# EAGLE schematic motherboard (EAGLE 6.1)
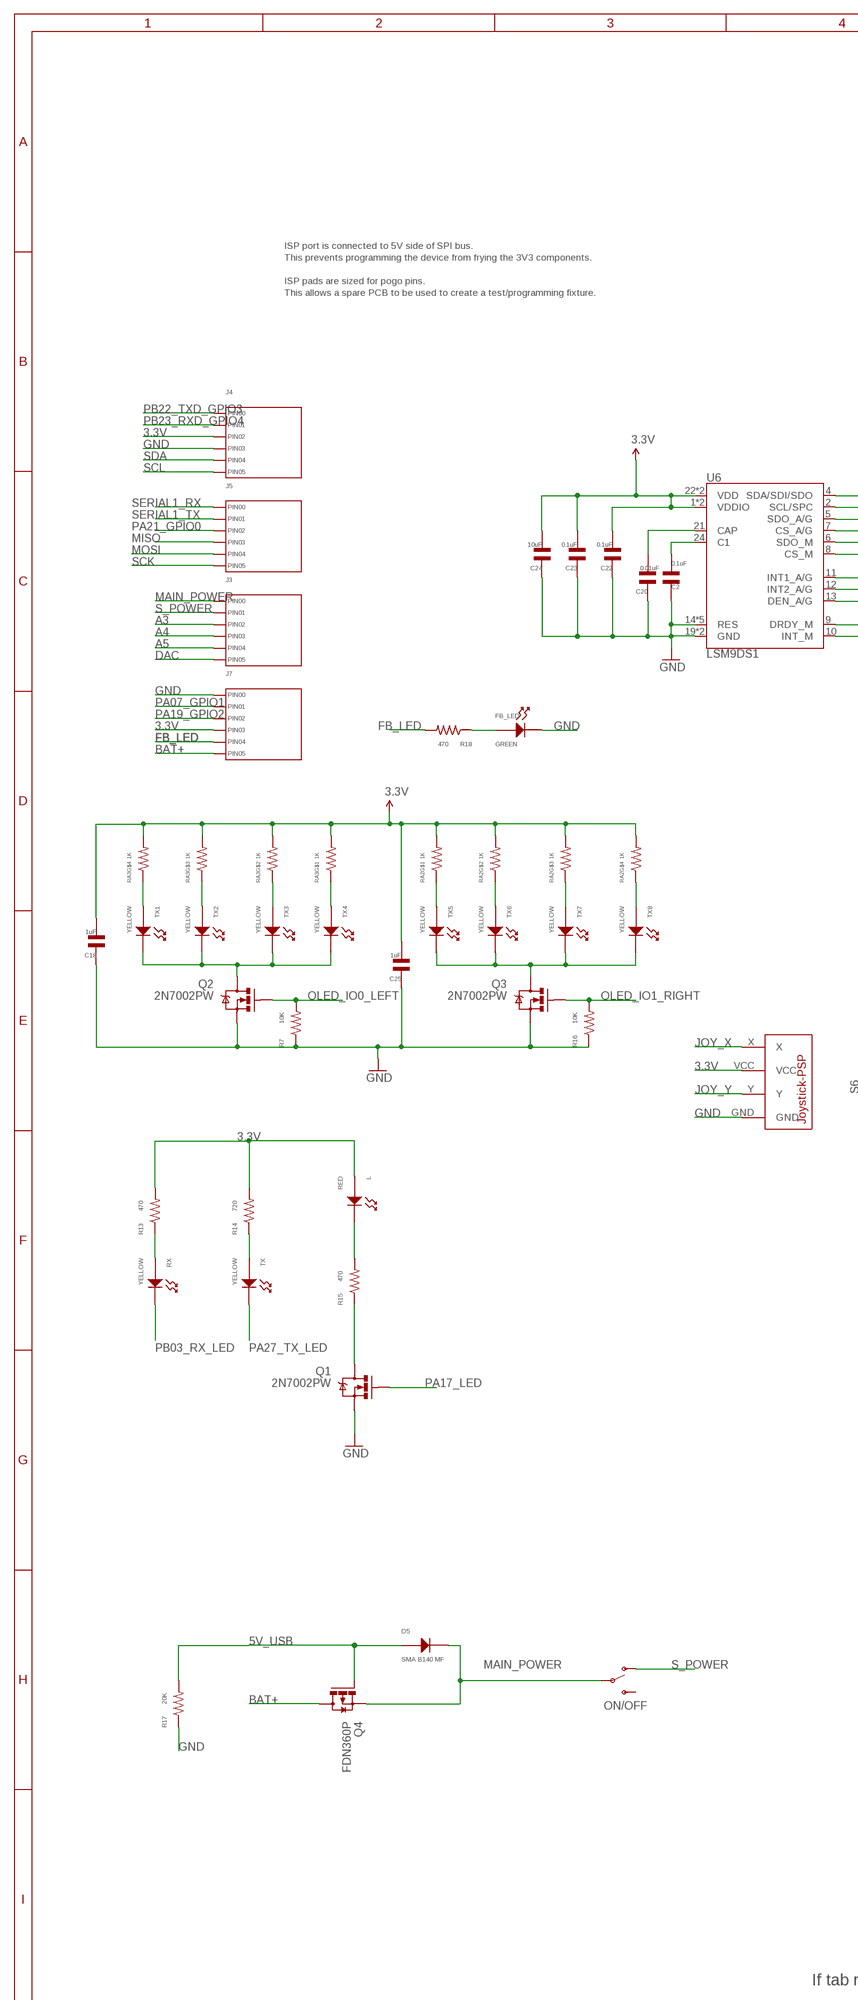
[diagram p0: schematic, sheet 1, part 1 of 2]
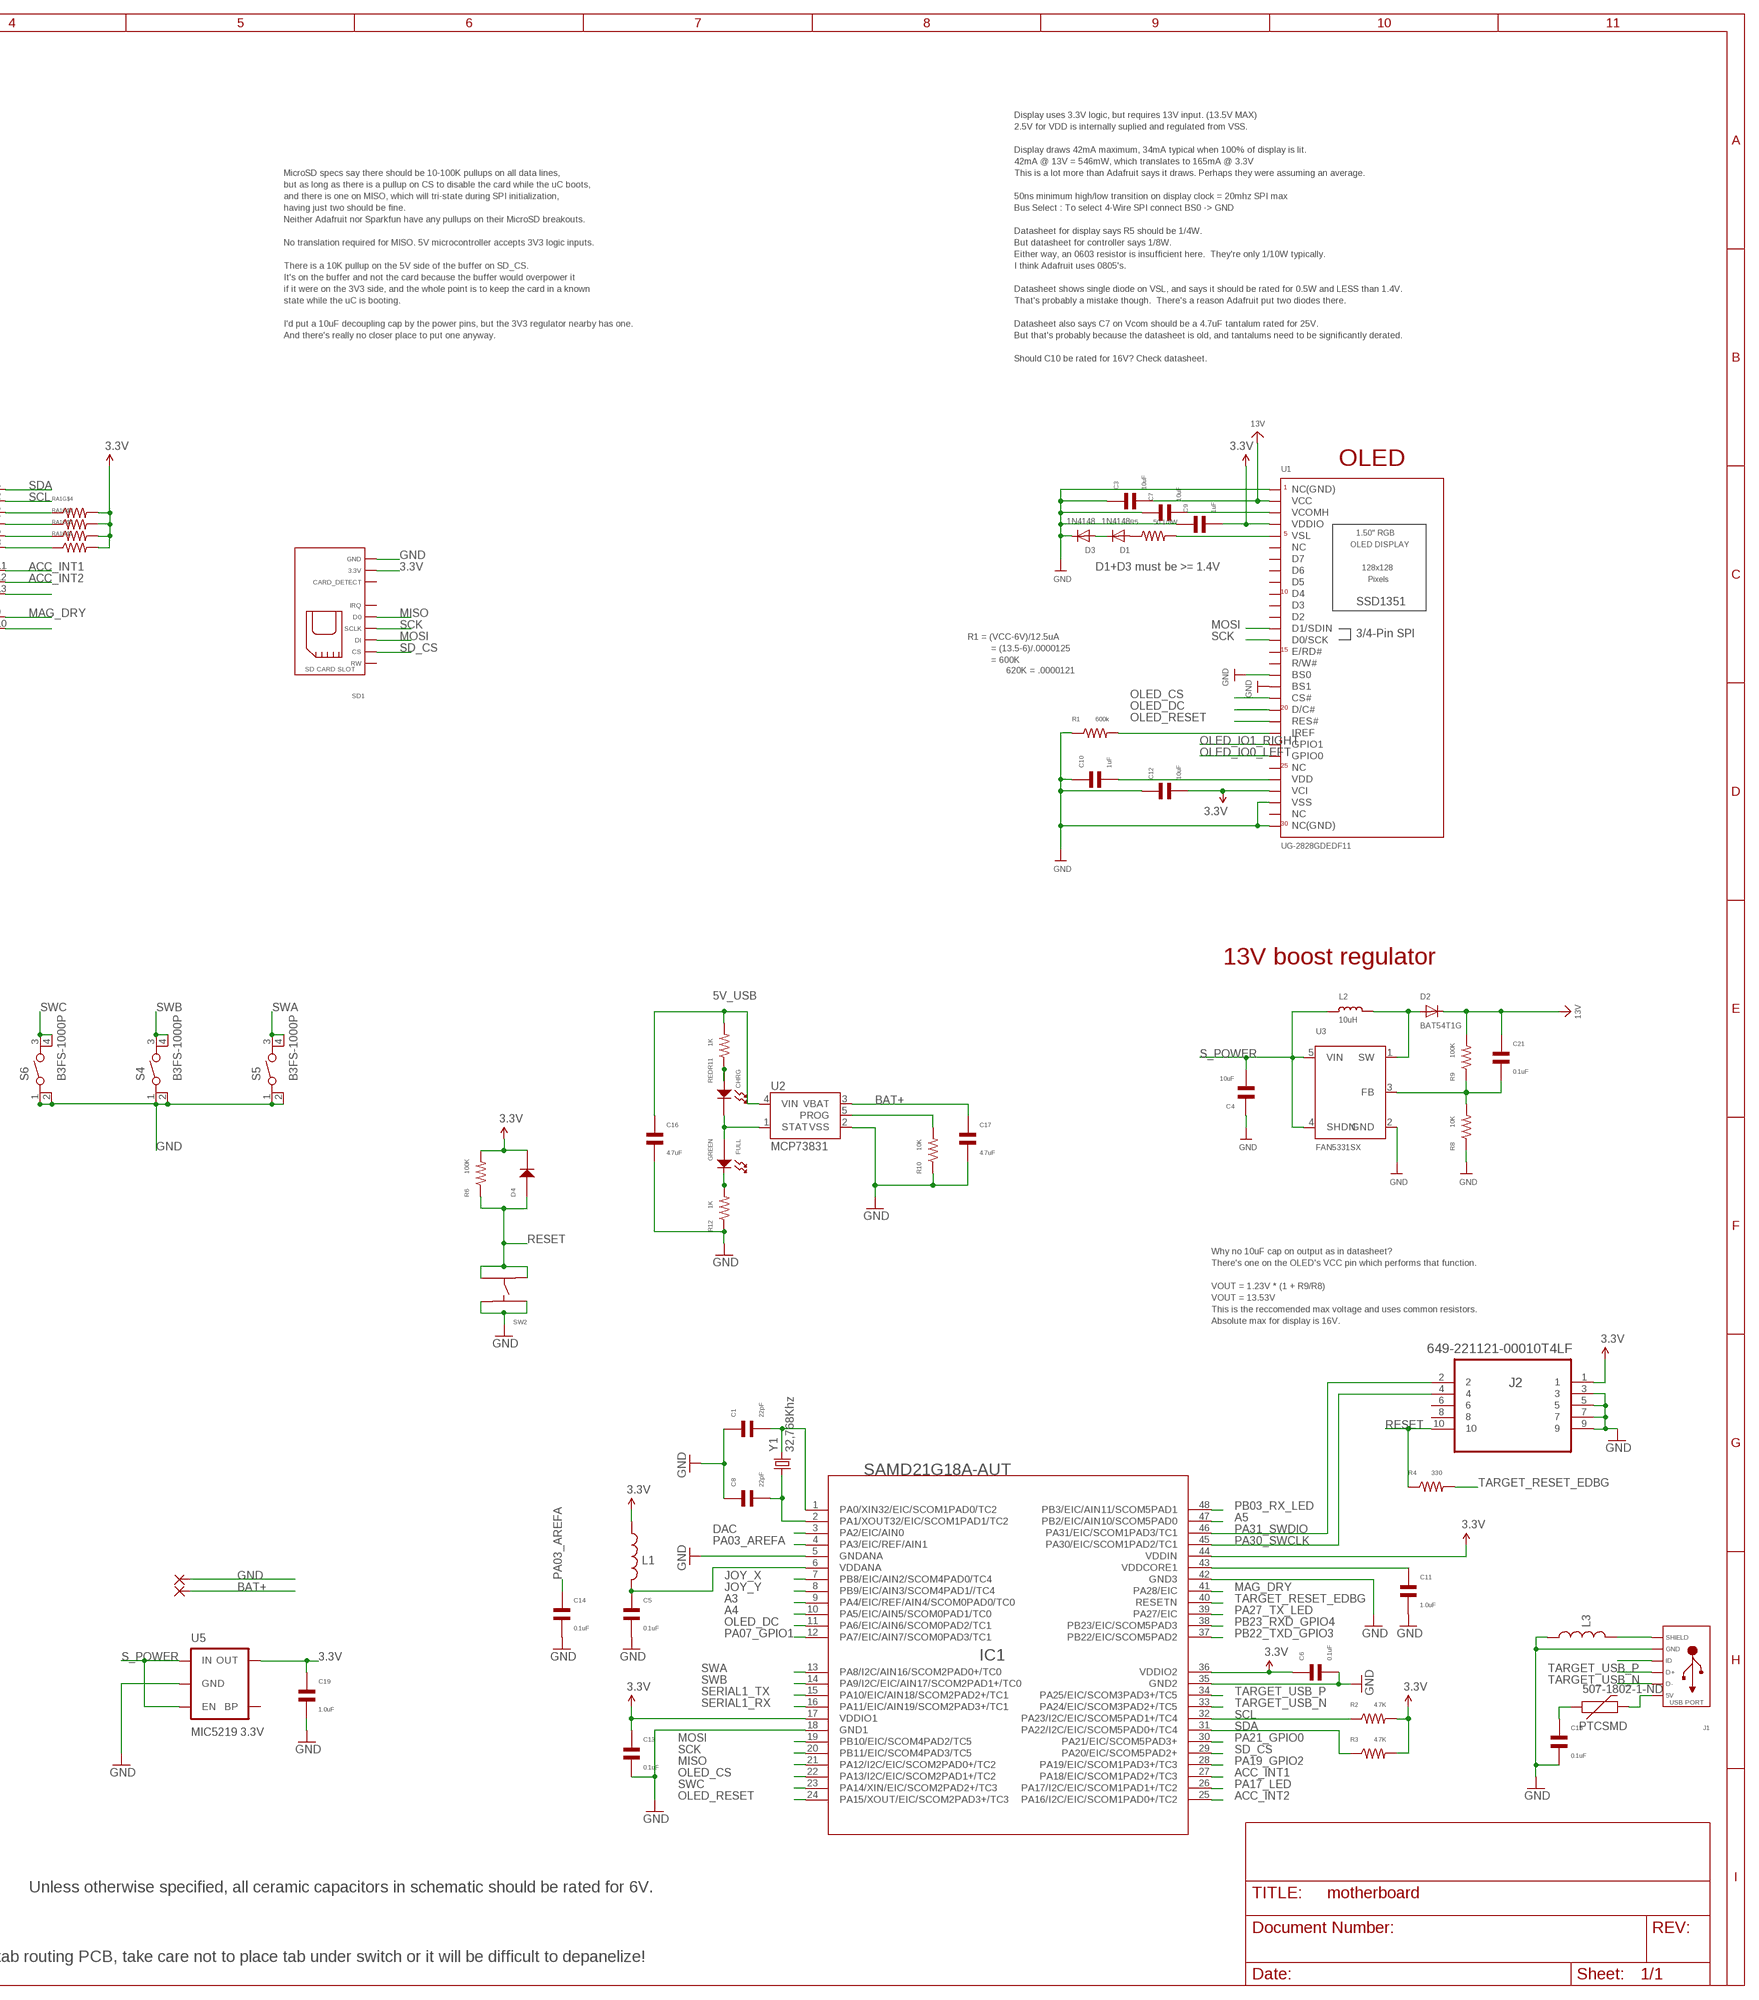
[diagram p1: schematic, sheet 1, part 2 of 2]

## Parts
507-1802-1-ND  PTCSMD  [PTC-1206]
C1  22pF  CAPACITOR_NP_0402  [C0402]
C2  0.1uF  CAPACITOR_NP_0402  [C0402]
C3  10uF  CAPACITOR_NP_0603  [C0603]
C4  10uF  CAPACITOR_NP_0603  [C0603]
C5  0.1uF  CAPACITOR_NP_0402  [C0402]
C6  0.1uF  CAPACITOR_NP_0402  [C0402]
C7  10uF  CAPACITOR_NP_0603  [C0603]
C8  22pF  CAPACITOR_NP_0402  [C0402]
C9  1uF  CAPACITOR_NP_0603  [C0603]
C10  1uF  CAPACITOR_NP_0603  [C0603]
C11  1.0uF  CAPACITOR_NP_0402  [C0402]
C12  10uF  CAPACITOR_NP_0603  [C0603]
C13  0.1uF  CAPACITOR_NP_0402  [C0402]
C14  0.1uF  CAPACITOR_NP_0402  [C0402]
C15  0.1uF  CAPACITOR_NP_0402  [C0402]
C16  4.7uF  CAPACITOR_NP_0603  [C0603]
C17  4.7uF  CAPACITOR_NP_0603  [C0603]
C18  1uF  CAPACITOR_NP_0402  [C0402]
C19  1.0uF  CAPACITOR_NP_0603  [C0603]
C20  0.01uF  CAPACITOR_NP_0402  [C0402]
C21  0.1uF  CAPACITOR_NP_0603  [C0603]
C22  0.1uF  CAPACITOR_NP_0402  [C0402]
C23  0.1uF  CAPACITOR_NP_0402  [C0402]
C24  10uF  CAPACITOR_NP_0603  [C0603]
C25  1uF  CAPACITOR_NP_0402  [C0402]
CHRG  RED  LED_SINGLE_0603  [LED0603]
D1  1N4148  DIODESOD-323  [SOD-323]
D2  BAT54T1G  DIODESOD-123  [SOD-123]
D3  1N4148  DIODESOD-323  [SOD-323]
D4  DIODE_SOD-123  [SOD-123]
D5  SMA B140 MF  DIODE_SMA  [SMA]
FB_LED  GREEN  LED_SINGLE_0603  [LED0603]
FULL  GREEN  LED_SINGLE_0603  [LED0603]
IC1  SAMD21G18A-AUT  INTEGRATEDCIRCUITS_1792_SAMD21G18A-AUT  [INTEGRATEDCIRCUITS_TQFP48-7X7]
J1  USB_MICRO_RIGHT  [MICROUSB-RIGHT]
J2  649-221121-00010T4LF  FTSH-105-01-L-DV  [SAMTEC_FTSH-105-01-L-DV]
J3  HEADER_01X06_PTH_2.54MM  [PTH_2.54MM_01X06]
J4  HEADER_01X06_PTH_2.54MM  [PTH_2.54MM_01X06]
J5  HEADER_01X06_PTH_2.54MM  [PTH_2.54MM_01X06]
J7  HEADER_01X06_PTH_2.54MM  [PTH_2.54MM_01X06]
L  RED  LED_SINGLE_0603  [LED0603]
L1  INDUCTOR0603-TDK  [0603-TDK]
L2  10uH  INDUCTOR  [INDUCTOR_1007]
L3  INDUCTOR0603-TDK  [0603-TDK]
ON/OFF  SWITCH-SPDT-SMD-A  [SWITCH-SPST-SMD-A]
PAD1  WIREPADSMD1,27-254  [SMD1,27-2,54]
PAD2  WIREPADSMD1,27-254  [SMD1,27-2,54]
Q1  2N7002PW  MOSFET-NCHANNEL2N7002PW  [SOT323]
Q2  2N7002PW  MOSFET-NCHANNEL2N7002PW  [SOT323]
Q3  2N7002PW  MOSFET-NCHANNEL2N7002PW  [SOT323]
Q4  FDN360P  [SUPER-SOT3]
R1  600k  RESISTOR_0603  [R0603]
R2  4.7K  RESISTOR_0402  [R0402]
R3  4.7K  RESISTOR_0402  [R0402]
R4  330  RESISTOR_0402  [R0402]
R5  50 1/8W  RESISTOR_0805  [R0805]
R6  100K  RESISTOR_0402  [R0402]
R7  10K  RESISTOR_0402  [R0402]
R8  10K  RESISTOR_0603  [R0603]
R9  100K  RESISTOR_0603  [R0603]
R10  10K  RESISTOR_0402  [R0402]
R11  1K  RESISTOR_0402  [R0402]
R12  1K  RESISTOR_0402  [R0402]
R13  470  RESISTOR_0402  [R0402]
R14  720  RESISTOR_0402  [R0402]
R15  470  RESISTOR_0402  [R0402]
R16  10K  RESISTOR_0402  [R0402]
R17  20K  RESISTOR_0402  [R0402]
R18  470  RESISTOR_0402  [R0402]
RA1  RESISTOR_QUAD_ARRAY_A1206  [RA1206]
RA2  1K  RESISTOR_QUAD_ARRAY_A1206  [RA1206]
RA3  1K  RESISTOR_QUAD_ARRAY_A1206  [RA1206]
RX  YELLOW  LED_SINGLE_0603  [LED0603]
S4  B3FS-1000P  [B3FS]
S5  B3FS-1000P  [B3FS]
S6  B3FS-1000P  [B3FS]
SD1  SD_CARD_SLOT_MICRO_RIGHT  [MICROSDSLOT-RIGHT]
SW2  TACT_4.2MM  [TACT4.2MM]
TX  YELLOW  LED_SINGLE_0603  [LED0603]
TX1  YELLOW  LED_SINGLE_0603  [LED0603]
TX2  YELLOW  LED_SINGLE_0603  [LED0603]
TX3  YELLOW  LED_SINGLE_0603  [LED0603]
TX4  YELLOW  LED_SINGLE_0603  [LED0603]
TX5  YELLOW  LED_SINGLE_0603  [LED0603]
TX6  YELLOW  LED_SINGLE_0603  [LED0603]
TX7  YELLOW  LED_SINGLE_0603  [LED0603]
TX8  YELLOW  LED_SINGLE_0603  [LED0603]
U1  UG-2828GDEDF11  DISP_OLED_UG-2828GDEDF11TOP  [FPC_XF2M-3015-1A]
U2  MCP73831  [SOT23-5]
U3  FAN5331SX  FAN5331  [SOT23-5]
U5  MIC5219 3.3V  V_REG_MIC52193.3V  [SOT23-5]
U6  LSM9DS1  [LGA24-8X4]
U$2  JOYSTICK-PSP1000  [JOYSTICK-PSP1000]
Y1  32,768Khz  CRYSTAL2012  [CRYSTAL-SMD-2.0X1.2]

## Nets
3.3V [10mil]: C6.P$1 C9.P$2 C12.P$2 C13.P$1 C18.P$2 C19.P$1 C22.P$2 C23.P$2 C24.P$2 C25.P$2 D4.CATHODE IC1.17(VDDIO1) IC1.36(VDDIO2) IC1.44(VDDIN) J2.1 J4.P$3(PIN2) J7.P$4(PIN3) L1.1 L.ANODE R2.P$2 R3.P$2 R6.P$2 R13.P$2 R14.P$2 RA1.P$5 RA1.P$6 RA1.P$7 RA1.P$8 RA2.P$5 RA2.P$6 RA2.P$7 RA2.P$8 RA3.P$5 RA3.P$6 RA3.P$7 RA3.P$8 SD1.PIN4(3.3V) U1.P$4(VCI) U1.P$27(VDDIO) U5.5(OUT) U6.1(VDDIO) U6.3(VDDIO) U6.22(VDD) U6.23(VDD) U$2.VCC
5V_NP [Large]: 507-1802-1-ND.2 J1.1(5V)
5V_USB [Large]: 507-1802-1-ND.1 C15.P$1 C16.P$1 D5.ANODE Q4.1(G) R11.P$2 R17.P$2 U2.4(VIN)
13V [10mil]: C3.P$2 C21.P$1 D2.C R9.P$2 U1.P$29(VCC)
A3: IC1.9(PA4/EIC/REF/AIN4/SCOM0PAD0/TC0) J3.P$3(PIN2)
A4: IC1.10(PA5/EIC/AIN5/SCOM0PAD1/TC0) J3.P$4(PIN3)
A5: IC1.47(PB2/EIC/AIN10/SCOM5PAD0) J3.P$5(PIN4)
ACC_INT1: IC1.27(PA18/EIC/SCOM1PAD2+/TC3) U6.11(INT1_A/G)
ACC_INT2: IC1.25(PA16/I2C/EIC/SCOM1PAD0+/TC2) U6.12(INT2_A/G)
BAT+ [Large]: C17.P$1 J7.P$6(PIN5) PAD1.1(P) Q4.3(D) U2.3(VBAT)
CHG_STATUS: CHRG.CATHODE FULL.ANODE U2.1(STAT)
DAC: IC1.3(PA2/EIC/AIN0) J3.P$6(PIN5)
FB: C21.P$2 R8.P$2 R9.P$1 U3.3(FB)
FB_LED [Large]: J7.P$5(PIN4) R18.P$2
GND [gnd]: C1.P$1 C2.P$2 C3.P$1 C4.P$1 C5.P$2 C6.P$2 C7.P$1 C8.P$1 C9.P$1 C10.P$1 C11.P$2 C12.P$1 C13.P$2 C14.P$2 C15.P$2 C16.P$2 C17.P$2 C18.P$1 C19.P$2 C20.P$1 C22.P$1 C23.P$1 C24.P$1 C25.P$1 D3.C FB_LED.CATHODE IC1.5(GNDANA) IC1.18(GND1) IC1.35(GND2) IC1.42(GND3) J1.5(GND) J2.3 J2.5 J2.7 J2.9 J4.P$4(PIN3) J7.P$1(PIN0) L3.1 PAD2.1(P) Q1.2(S) Q2.2(S) Q3.2(S) R1.P$1 R7.P$1 R8.P$1 R10.P$1 R12.P$1 R16.P$1 R17.P$1 S4.1(A1) S4.2(A2) S5.1(A1) S5.2(A2) S6.1(A1) S6.2(A2) SD1.G0(GND) SD1.G1(GND) SD1.PIN6(GND) SW2.P$1 SW2.P$2 U1.P$1(NC(GND)) U1.P$3(VSS) U1.P$13(BS1) U1.P$14(BS0) U1.P$30(NC(GND)) U2.2(VSS) U3.2(GND) U5.2(GND) U6.14(RES) U6.15(RES) U6.16(RES) U6.17(RES) U6.18(RES) U6.19(GND) U6.20(GND) U$2.GND
JOY_X: IC1.7(PB8/EIC/AIN2/SCOM4PAD0/TC4) U$2.X
JOY_Y: IC1.8(PB9/EIC/AIN3/SCOM4PAD1//TC4) U$2.Y
MAG_DRY: IC1.41(PA28/EIC) U6.9(DRDY_M)
MAIN_POWER: D5.CATHODE J3.P$1(PIN0) ON/OFF.2(P) Q4.2(S)
MISO: IC1.21(PA12/I2C/EIC/SCOM2PAD0+/TC2) J5.P$4(PIN3) SD1.PIN7(D0)
MOSI: IC1.19(PB10/EIC/SCOM4PAD2/TC5) J5.P$5(PIN4) SD1.PIN3(DI) U1.P$18(D1/SDIN)
N$1: R10.P$2 U2.5(PROG)
N$2 [10mil]: Q2.3(D) TX1.CATHODE TX2.CATHODE TX3.CATHODE TX4.CATHODE
N$3: D1.A R5.P$1
N$4: C10.P$2 U1.P$5(VDD)
N$5: CHRG.ANODE R11.P$1
N$6: J1.S1(SLD) J1.S2(SLD) J1.S3(SLD) J1.S4(SLD) J1.S5(SLD) J1.S6(SLD) L3.2
N$7: Q3.3(D) TX5.CATHODE TX6.CATHODE TX7.CATHODE TX8.CATHODE
N$8: R1.P$2 U1.P$9(IREF)
N$9: R13.P$1 RX.ANODE
N$10: R14.P$1 TX.ANODE
N$11: J1.4(ID)
N$12: FULL.CATHODE R12.P$2
N$13: Q1.3(D) R15.P$1
N$14: L.CATHODE R15.P$2
N$15 [10mil]: RA2.P$1 TX5.ANODE
N$16 [10mil]: RA2.P$2 TX6.ANODE
N$17: RA1.P$4 U6.5(SDO_A/G)
N$18: RA1.P$2 U6.7(CS_A/G)
N$19: RA1.P$3 U6.6(SDO_M)
N$20: RA1.P$1 U6.8(CS_M)
N$21 [10mil]: RA2.P$3 TX7.ANODE
N$22 [10mil]: RA2.P$4 TX8.ANODE
N$23: U6.13(DEN_A/G)
N$24: FB_LED.ANODE R18.P$1
N$25: U6.10(INT_M)
N$26 [10mil]: RA3.P$1 TX4.ANODE
N$27: C20.P$2 U6.21(CAP)
N$28: C2.P$1 U6.24(C1)
N$29 [10mil]: RA3.P$2 TX3.ANODE
N$30 [10mil]: RA3.P$3 TX2.ANODE
N$31 [10mil]: RA3.P$4 TX1.ANODE
OLED_CS: IC1.22(PA13/I2C/EIC/SCOM2PAD1+/TC2) U1.P$12(CS#)
OLED_DC: IC1.11(PA6/EIC/AIN6/SCOM0PAD2/TC1) U1.P$11(D/C#)
OLED_IO0_LEFT: Q2.1(G) R7.P$2 U1.P$7(GPIO0)
OLED_IO1_RIGHT: Q3.1(G) R16.P$2 U1.P$8(GPIO1)
OLED_RESET: IC1.24(PA15/XOUT/EIC/SCOM2PAD3+/TC3) U1.P$10(RES#)
PA00_XIN32: C1.P$2 IC1.1(PA0/XIN32/EIC/SCOM1PAD0/TC2) Y1.2
PA01_XOUT32: C8.P$2 IC1.2(PA1/XOUT32/EIC/SCOM1PAD1/TC2) Y1.1
PA03_AREFA: C14.P$1 IC1.4(PA3/EIC/REF/AIN1)
PA07_GPIO1: IC1.12(PA7/EIC/AIN7/SCOM0PAD3/TC1) J7.P$2(PIN1)
PA17_LED: IC1.26(PA17/I2C/EIC/SCOM1PAD1+/TC2) Q1.1(G)
PA19_GPIO2: IC1.28(PA19/EIC/SCOM1PAD3+/TC3) J7.P$3(PIN2)
PA21_GPIO0: IC1.30(PA21/EIC/SCOM5PAD3+) J5.P$3(PIN2)
PA27_TX_LED: IC1.39(PA27/EIC) TX.CATHODE
PA30_SWCLK: IC1.45(PA30/EIC/SCOM1PAD2/TC1) J2.4
PA31_SWDIO: IC1.46(PA31/EIC/SCOM1PAD3/TC1) J2.2
PB03_RX_LED: IC1.48(PB3/EIC/AIN11/SCOM5PAD1) RX.CATHODE
PB22_TXD_GPIO3: IC1.37(PB22/EIC/SCOM5PAD2) J4.P$1(PIN0)
PB23_RXD_GPIO4: IC1.38(PB23/EIC/SCOM5PAD3) J4.P$2(PIN1)
RESET: D4.ANODE J2.10 R4.P$1 R6.P$1 SW2.P$3 SW2.P$4
S_POWER [Large]: C4.P$2 J3.P$2(PIN1) L2.P$1 ON/OFF.1(O) U3.4(SHDN) U3.5(VIN) U5.1(IN) U5.3(EN)
SCK: IC1.20(PB11/EIC/SCOM4PAD3/TC5) J5.P$6(PIN5) SD1.PIN5(SCLK) U1.P$17(D0/SCK)
SCL: IC1.32(PA23/I2C/EIC/SCOM5PAD1+/TC4) J4.P$6(PIN5) R2.P$1 U6.2(SCL/SPC)
SD_CS: IC1.29(PA20/EIC/SCOM5PAD2+) SD1.PIN2(CS)
SDA: IC1.31(PA22/I2C/EIC/SCOM5PAD0+/TC4) J4.P$5(PIN4) R3.P$1 U6.4(SDA/SDI/SDO)
SERIAL1_RX: IC1.16(PA11/EIC/AIN19/SCOM2PAD3+/TC1) J5.P$1(PIN0)
SERIAL1_TX: IC1.15(PA10/EIC/AIN18/SCOM2PAD2+/TC1) J5.P$2(PIN1)
SW: D2.A L2.P$2 U3.1(SW)
SWA: IC1.13(PA8/I2C/AIN16/SCOM2PAD0+/TC0) S5.3(B1) S5.4(B2)
SWB: IC1.14(PA9/I2C/EIC/AIN17/SCOM2PAD1+/TC0) S4.3(B1) S4.4(B2)
SWC: IC1.23(PA14/XIN/EIC/SCOM2PAD2+/TC3) S6.3(B1) S6.4(B2)
TARGET_RESET_EDBG: IC1.40(RESETN) R4.P$2
TARGET_USB_N: IC1.33(PA24/EIC/SCOM3PAD2+/TC5) J1.2(D-)
TARGET_USB_P: IC1.34(PA25/EIC/SCOM3PAD3+/TC5) J1.3(D+)
VCOMH: C7.P$2 U1.P$28(VCOMH)
VDDANA: C5.P$1 IC1.6(VDDANA) L1.2
VDDCORE: C11.P$1 IC1.43(VDDCORE1)
VSL: R5.P$2 U1.P$26(VSL)
VSL/3: D1.C D3.A
Unconnected: J2.6 J2.8 ON/OFF.3(S) SD1.PIN1(RW) SD1.PIN8(IRQ) SD1.PIN9(CRD_DTCT) SD1.PIN10(CRD_DTCT) U1.P$2(NC) U1.P$6(NC) U1.P$15(R/W#) U1.P$16(E/RD#) U1.P$19(D2) U1.P$20(D3) U1.P$21(D4) U1.P$22(D5) U1.P$23(D6) U1.P$24(D7) U1.P$25(NC) U5.4(BP)

## Notes on the sheet
- Display uses 3.3V logic, but requires 13V input. (13.5V MAX)
- 2.5V for VDD is internally suplied and regulated from VSS.
- Display draws 42mA maximum, 34mA typical when 100% of display is lit.
- 42mA @ 13V = 546mW, which translates to 165mA @ 3.3V
- MicroSD specs say there should be 10-100K pullups on all data lines, | This is a lot more than Adafruit says it draws. Perhaps they were assuming an average.
- but as long as there is a pullup on CS to disable the card while the uC boots,
- and there is one on MISO, which will tri-state during SPI initialization, | 50ns minimum high/low transition on display clock = 20mhz SPI max
- having just two should be fine. | Bus Select : To select 4-Wire SPI connect BS0 -> GND
- Neither Adafruit nor Sparkfun have any pullups on their MicroSD breakouts.
- Datasheet for display says R5 should be 1/4W.
- ISP port is connected to 5V side of SPI bus. | No translation required for MISO. 5V microcontroller accepts 3V3 logic inputs. | But datasheet for controller says 1/8W.
- This prevents programming the device from frying the 3V3 components. | Either way, an 0603 resistor is insufficient here.  They're only 1/10W typically.
- There is a 10K pullup on the 5V side of the buffer on SD_CS. | I think Adafruit uses 0805's.
- ISP pads are sized for pogo pins. | It's on the buffer and not the card because the buffer would overpower it
- This allows a spare PCB to be used to create a test/programming fixture. | if it were on the 3V3 side, and the whole point is to keep the card in a known | Datasheet shows single diode on VSL, and says it should be rated for 0.5W and LESS than 1.4V.
- state while the uC is booting. | That's probably a mistake though.  There's a reason Adafruit put two diodes there.
- I'd put a 10uF decoupling cap by the power pins, but the 3V3 regulator nearby has one. | Datasheet also says C7 on Vcom should be a 4.7uF tantalum rated for 25V.
- And there's really no closer place to put one anyway. | But that's probably because the datasheet is old, and tantalums need to be significantly derated.
- Should C10 be rated for 16V? Check datasheet.
- OLED
- D1+D3 must be >= 1.4V
- R1 = (VCC-6V)/12.5uA
- = (13.5-6)/.0000125
- = 600K
- 620K = .0000121
- 13V boost regulator
- Why no 10uF cap on output as in datasheet?
- There's one on the OLED's VCC pin which performs that function.
- VOUT = 1.23V * (1 + R9/R8)
- VOUT = 13.53V
- This is the reccomended max voltage and uses common resistors.
- Absolute max for display is 16V.
- Unless otherwise specified, all ceramic capacitors in schematic should be rated for 6V.
- If tab routing PCB, take care not to place tab under switch or it will be difficult to depanelize!

## Library data of the parts
507-1802-1-ND = SparkFun-PowerIC:PTC: Resettable Fuse PTC Resettable Fuse. Spark Fun Electronics SKU : COM-08357; PROD_ID: RES-11150
C1-C25 = MF_Passives:CAPACITOR_NP: Library: MF_Passives Description: Device for Non-Polarized Capacitors. Manufacture part number (MFG#), Voltage, Temperature Coefficient, and Tolerance can be added via Attributes.; MFG#: N/A; TEMP_COF: N/A; TOLERANCE: N/A; VOLTAGE: N/A
CHRG FB_LED FULL L RX TX TX1-TX8 = MF_LEDs:LED_SINGLE: Library: MF_LEDs Description: Device for Single LED Packages. Manufacture part number (MFG#) can be added via Attributes.; MFG#: N/A
D1-D3 = microbuilder:DIODE: Diode SMA Model Volts Amps Type Vf Vr Digikey # Notes SSA34-E3 40V 3A Schottky 480mV @ 3A 200uA @ 40V SSA34-E3/61TGITR-ND CDBA120-G 20V 1A Schottky 500mV @ 1A 500uA @ 20V 641-1014-6-ND REEL MBRA210 10V 2A Schottky 350mV @ 2A 700uA @ 10V MBRA210LT3 SOD-123 Model Volts Amps Type Vf Vr Order # Notes BAT54T1G 30V 200mA Schottky 800mV @ 200mA 2uA @ 25V BAT54T1GOSTR-ND B0530W 30V 500mA Schottky 430mV @ 500mA 130uA @ 30V B0530W-FDICT-ND REEL MBR120 1A 20V Schottky 340mV @ 1A MBR120VLSFT1GOSCT-ND SOD-323 Model Volts Amps Type Vf Vr Order # Notes PMEG2005EJ 20V 500mA Schottky 355mV @ 500mA 568-4110-1-ND ZLLS410 10V 570mA Schottky 380mV @ 570mA ZLLS410CT-ND 1N4148WS 75V 150mA Silicon/Simple 1V 1N4148WSFSCT-ND REEL SOD-523 Model Volts Amps Type Vf Vr Order # Notes BAT54XV2 30V 200mA Schottky 0.8V @ 100mA BAT54XV2CT-ND TB751S 30V 30mA Schottky RB751S-40TE61CT-ND SOT23-R/W (R = Solder Paste/Reflow Ovens, W = Hand-Soldering) Model Volts Amps Type Vf Vr Order # Notes BAT54FILM 40V 300mA Schottky 497-7162-1-ND
D4 D5 = MF_Discrete_Semiconductor:DIODE: Library: MF_Discrete_Semiconductor Description: Device for Single Packaged Diodes. Manufacture part number (MFG#) can be added via Attributes.; MFG#: N/A
IC1 = Arduino-Neutrino-082:INTEGRATEDCIRCUITS_1792_SAMD21G18A-AUT: Atmel D21 32bit ARM Cortex-M0 microcontroller - 48 PIN TQFP 256KB flash memory + 32KB SRAM
J1 = MF_Connectors:USB: Library: MF_Connectors Description: 5 Pin USB Connectors. SLD is the shield connection. Usually tied to ground through a small ferrite bead.
J2 = SAMTEC-HTSW-FTxx_By_element14_Batch_1:FTSH-105-01-L-DV: CONN HEADER, 1.27MM, 2X5WAY, SMT; MPN: FTSH-105-01-L-DV; OC_FARNELL: 1667759; OC_NEWARK: 11P4814; PACKAGE: HEADER, 1.27MM, 2X5WAY, SMT; SUPPLIER: SAMTEC
J3-J5 J7 = MF_Connectors:HEADER_01X06: Library: MF_Connectors Description: Header Connector with 6 Positions and 01 Rows. Use the LABEL Attribute to label the pin on the schematic and PCB. You can remove the attributes on the PCB by using the SMASH function on the part and then deleting the text.
L1 L3 = SparkFun-Passives:INDUCTOR: Inductors
L2 = microbuilder:INDUCTOR: Inductors
ON/OFF = SparkFun-Electromechanical:SWITCH-SPDT: SPDT Switch Simple slide switch, Spark Fun Electronics SKU : COM-00102 DPDT SMT slide switch, AYZ0202, SWCH-08179
PAD1 PAD2 = wirepad:WIREPAD: Wire PAD connect wire on PCB
Q1-Q3 = SparkFun-DiscreteSemi:MOSFET-NCHANNEL: Common NMOSFET Parts MFG P/N Store ID Prod ID FDD8780 TRANS-09984 SI7820DN TRANS-11055 FDS6630A IC-08089 2N7002PW TRANS-11151 FQP30N06L COM-10213 TRANS-10060 BSS123LT1G TRANS-08345 BSS138 TRANS-00830 BS170 2N7000; PROD_ID: TRANS-11151
Q4 = transistor-power:FDN360P: Single P-Channel, PowerTrench (R) MOSFET Source: http://www.fairchildsemi.com/ds/FD/FDN360P.pdf
R1-R18 = MF_Passives:RESISTOR: Library: MF_Passives Description: Device for Resistors. Manufacture part number (MFG#), Voltage, Tolerance, and Wattage Rating can be added via Attributes.; MFG#: N/A; TOLERANCE: N/A; VOLTAGE: N/A; WATTAGE: N/A
RA1-RA3 = MF_Passives:RESISTOR_QUAD_ARRAY: Library: MF_Passives Description: Device for Quad Resistor Arrays. Manufacture part number (MFG#), Voltage, Tolerance, and Wattage Rating can be added via Attributes.; MFG#: N/A; TOLERANCE: N/A; VOLTAGE: N/A; WATTAGE: N/A
S4-S6 = ahs:B3FS-1000P: Surface mount SPST
SD1 = MF_Connectors:SD_CARD_SLOT: Library: MF_Connectors Description: SD Card Connector
SW2 = MF_Switches:TACT: Library: MF_Switches Description: Device for Tact Switches. Manufacture part number (MFG#) can be added via Attributes.
U1 = microbuilder:DISP_OLED_UG-2828GDEDF11: 128x128 1.5" RGB OLED - UG-2828GDEDF11 30-Pin 0.5mm Pitch FPC Cable (Top+Bottom Contacts) - OMRON XF2M-3015-1A (Digikey: OR723TR-ND) This FPC connector has contacts on the top and bottom, but the appropriate pin needs to be selected depending on whether the OLED will be inserted right-side up (use the TOP pinout) or upside-down (use the BOTTOM pinout).
U2 = SparkFun-PowerIC:MCP73831: Miniature single cell, fully integrated Li-Ion, Li-polymer charge management controller http://ww1.microchip.com/downloads/en/DeviceDoc/21984a.pdf IC-09995; PROD_ID: IC-09995
U3 = microbuilder:FAN5331: FAN5331 - LED/OLED 20V Boost Converter Digikey: FAN5331SXCT-ND
U5 = SparkFun-PowerIC:V_REG_MIC5219: V_REG MIC5219 Standard 3.3V and 5V 500mA LDO voltage regulator in SOT-23 layout. Micrel part MIC5219. BP (by-pass) pin is used to lower output noise with 470pF cap, may be left open.; PROD_ID: VREG-09872
U6 = SparkFun-Sensors:LSM9DS1: LSM9DS1 3D accelerometer, gyroscope & magnetometer The LSM9DS1 is a system-in-package featuring a 3D digital linear acceleration sensor, a 3D digital angular rate sensor, and a 3D digital magnetic sensor. The LSM9DS1 has a linear acceleration full scale of ±2g/±4g/±8/±16 g, a magnetic field full scale of ±4/±8/±12/±16 gauss and an angular rate of ±245/±500/±2000 dps. The LSM9DS1 includes an I2 C serial bus interface supporting standard and fast mode (100 kHz and 400 kHz) and an SPI serial standard interface. Magnetic, accelerometer and gyroscope sensing can be enabled or set in power-down mode separately for smart power management. The LSM9DS1 is available in a plastic land grid array package (LGA) and it is guaranteed to operate over an extended temperature range from -40 °C to +85 °C.; PROD_ID: IC-12536
U$2 = SparkFun-Electromechanical:JOYSTICK-PSP1000: This is a footprint for the PSP-1000 Joystick. 4-pins: X, Y, Vcc and GND
Y1 = SparkFun-FreqCtrl:CRYSTAL: Various standard crystals. Proven footprints. Spark Fun Electronics SKU : COM-00534

## Net classes
0 default: width 0.254 mm, drill 0.305 mm, clearance 0.203 mm
1 Large: width 0.406 mm
2 gnd: width 0.203 mm, drill 0.305 mm, clearance 0.152 mm
3 3.3V: width 0.305 mm
4 USBpair: width 0.254 mm, drill 0.305 mm, clearance 0.254 mm
5 10mil: width 0.254 mm, drill 0.305 mm, clearance 0.203 mm